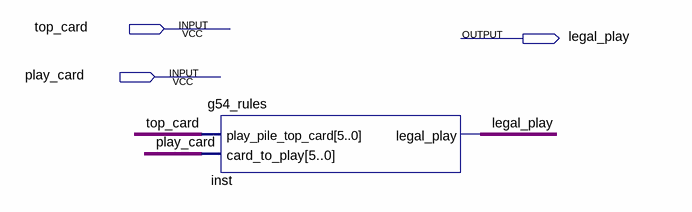
[diagram p0: schematic sheet]
// Quartus schematic rules.bdf as structural Verilog: 1 symbols, 3 pins
module rules (
  input  top_card,
  input  play_card,
  output legal_play
);

  g54_rules inst (.play_pile_top_card({6{top_card}}), .card_to_play({6{play_card}}), .legal_play(legal_play));
endmodule
